# Altium project SwitchPCB.PrjPcb
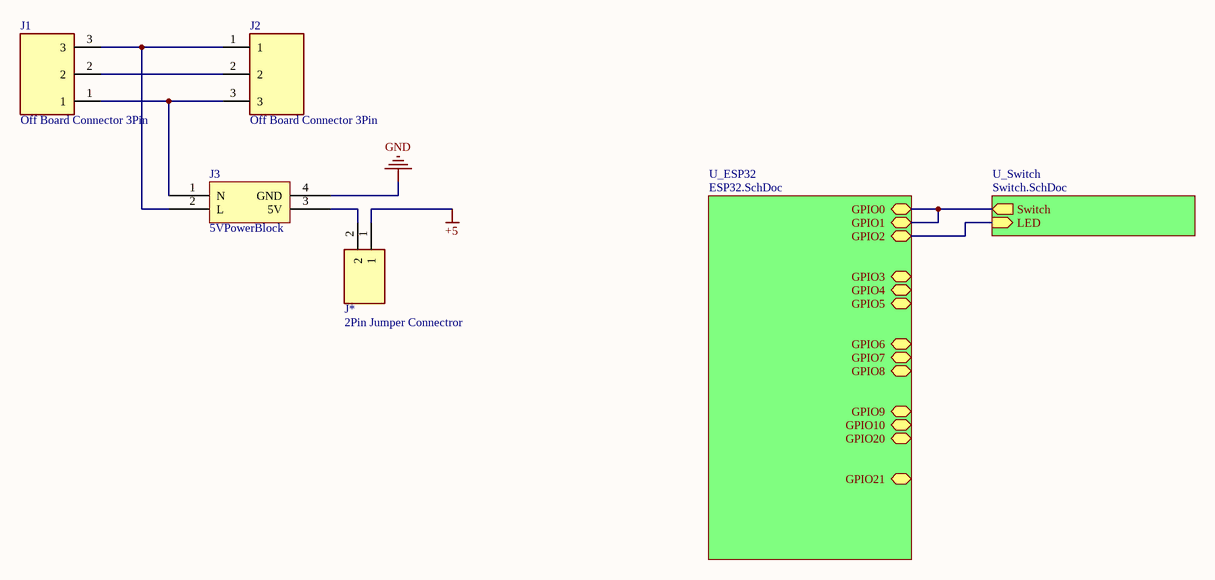
[diagram p0: Top.SchDoc]
3 sheets, 8 parts. Net scope: hierarchical (ports join the sheet entries above them; power ports are global).
Board files: PCB_V1.PcbDoc, PCB_V2_SingleSwitch.PcbDoc
Sheets:
  Top.SchDoc
    U_ESP32 = ESP32.SchDoc
    U_Switch = Switch.SchDoc

## Sheet Top.SchDoc
size A4; SheetNumber: 1; SheetTotal: 3

### Parts
J1  Off Board Connector 3Pin  [OFF BORAD CONNECTOR 3PIN]
J2  Off Board Connector 3Pin  [OFF BORAD CONNECTOR 3PIN]
J3  5VPowerBlock  [5VPowerBlock]
J*  2Pin Jumper Connectror  [2Pin Jumper]

### Sub-sheets
U_ESP32 = ESP32.SchDoc: GPIO21 (bidir), GPIO20 (bidir), GPIO10 (bidir), GPIO9 (bidir), GPIO8 (bidir), GPIO7 (bidir), GPIO6 (bidir), GPIO5 (bidir), GPIO0 (bidir), GPIO1 (bidir), GPIO2 (bidir), GPIO3 (bidir), GPIO4 (bidir)
U_Switch = Switch.SchDoc: LED (in), Switch (out)

### Nets
+5: J*.1
GND: J3.4(GND)
NetJ1_1: J1.1 J2.3 J3.1(N)
NetJ1_2: J1.2 J2.2
NetJ1_3: J1.3 J2.1 J3.2(L)
NetJ3_3: J3.3(5V) J*.2
NetR1_1: sheet U_ESP32/GPIO2, sheet U_Switch/LED
NetR2_1: sheet U_ESP32/GPIO0, sheet U_ESP32/GPIO1, sheet U_Switch/Switch

### Library data of the parts
J1 J2 = CMP-007-000001-2: Screw Connector; Design Item ID: Off Board Connector 3Pin; Source: Basic.SchLib
J3 = CMP-012-000011-1: Source: Basic.SchLib; Design Item ID: 5VPowerBlock
J* = CMP-007-000002-1

## Sheet ESP32.SchDoc
size A4; SheetNumber: 2; SheetTotal: 3
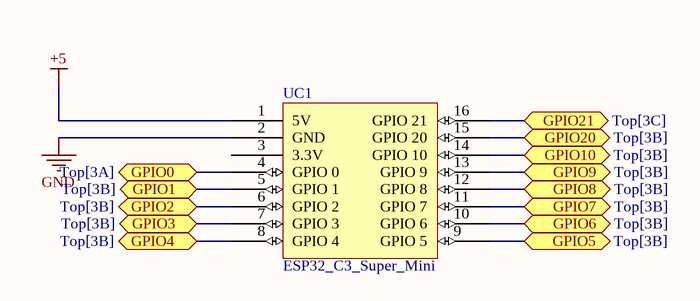
[diagram p1: ESP32.SchDoc]

### Parts
UC1  ESP32_C3_Super_Mini  [ESP32_C3_Super_Mini]

### Ports
GPIO0 (bidir, see Top[3A]), GPIO1 (bidir, see Top[3B]), GPIO2 (bidir, see Top[3B]), GPIO3 (bidir, see Top[3B]), GPIO4 (bidir, see Top[3B]), GPIO5 (bidir, see Top[3B]), GPIO6 (bidir, see Top[3B]), GPIO7 (bidir, see Top[3B]), GPIO8 (bidir, see Top[3B]), GPIO9 (bidir, see Top[3B]), GPIO10 (bidir, see Top[3B]), GPIO20 (bidir, see Top[3B]), GPIO21 (bidir, see Top[3C])

### Nets
+5: UC1.1(5V)
GND: UC1.2(GND)
NetR1_1: UC1.6(GPIO_2) ; port GPIO2
NetR2_1: UC1.4(GPIO_0) UC1.5(GPIO_1) ; port GPIO0, port GPIO1
NetUC1_7: UC1.7(GPIO_3) ; port GPIO3
NetUC1_8: UC1.8(GPIO_4) ; port GPIO4
NetUC1_9: UC1.9(GPIO_5) ; port GPIO5
NetUC1_10: UC1.10(GPIO_6) ; port GPIO6
NetUC1_11: UC1.11(GPIO_7) ; port GPIO7
NetUC1_12: UC1.12(GPIO_8) ; port GPIO8
NetUC1_13: UC1.13(GPIO_9) ; port GPIO9
NetUC1_14: UC1.14(GPIO_10) ; port GPIO10
NetUC1_15: UC1.15(GPIO_20) ; port GPIO20
NetUC1_16: UC1.16(GPIO_21) ; port GPIO21

Not connected (* = marked no-connect by the designer): UC1 3(3.3V)

### Library data of the parts
UC1 = CMP-003-000012-3: Source: Components.SchLib; Design Item ID: ESP32_C3_Super_Mini

## Sheet Switch.SchDoc
size A4; SheetNumber: 3; SheetTotal: 3
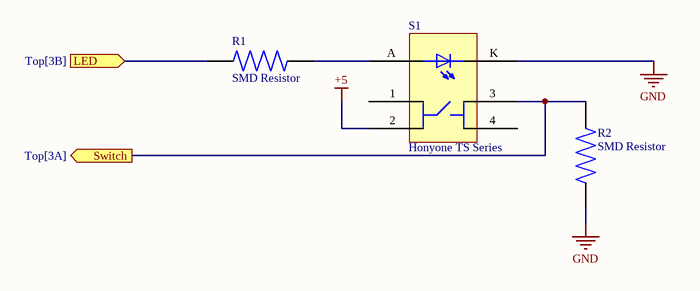
[diagram p2: Switch.SchDoc]

### Parts
R1  SMD Resistor  [SMD Resistor]
R2  SMD Resistor  [SMD Resistor]
S1  Honyone TS Series  [Honyone TS Series]

### Ports
LED (in, see Top[3B]), Switch (out, see Top[3A])

### Nets
+5: S1.2
GND: R2.2 S1.K
NetR1_1: R1.1 ; port LED
NetR1_2: R1.2 S1.A
NetR2_1: R2.1 S1.3 ; port Switch

Not connected (* = marked no-connect by the designer): S1 1 4

### Library data of the parts
R1 R2 = CMP-009-000002-1: Source: Basic.SchLib; Design Item ID: SMD Resistor
S1 = CMP-012-000009-3: Design Item ID: Honyone TS Series; Source: Basic.SchLib

## Nets that join several sheets
+5: Top (J*.1), ESP32 (UC1.1), Switch (S1.2)
GND: Top (J3.4), ESP32 (UC1.2), Switch (R2.2 S1.K)
NetR1_1: ESP32 (UC1.6), Switch (R1.1)
NetR2_1: ESP32 (UC1.4 UC1.5), Switch (R2.1 S1.3)